# EAGLE schematic schematic (EAGLE 9.4.0)
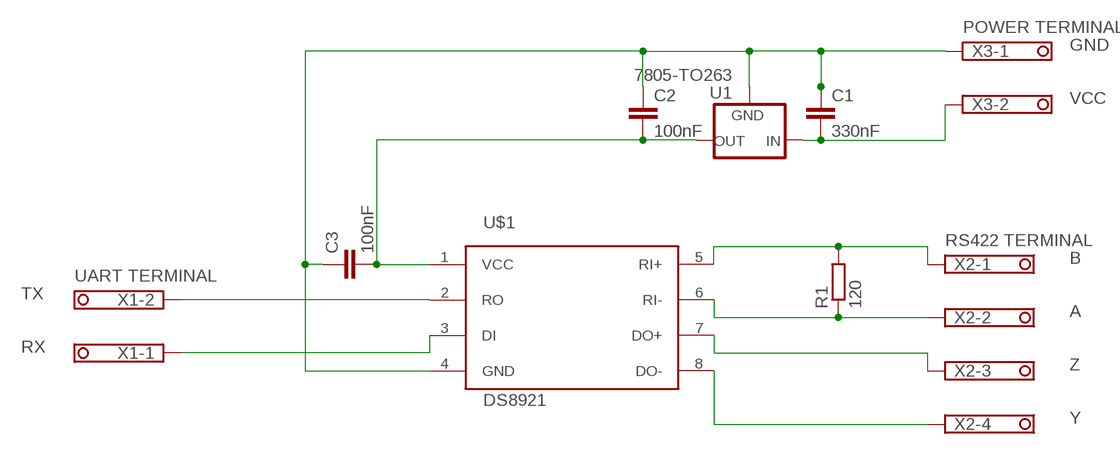
[diagram p0: schematic, sheet 1]

## Parts
C1  330nF  C-EUC1206K  [C1206K]
C2  100nF  C-EUC1206K  [C1206K]
C3  100nF  C-EUC1206K  [C1206K]
R1  120  R-EU_R1206  [R1206]
U1  7805-TO263  L78XXD2TT  [D2PAK]
U$1  DS8921  [SOIC8]
X1  1751248  [1751248]
X2  1751264  [1751264]
X3  1751248  [1751248]

## Nets
N$1: C1.1 C2.1 C3.1 U1.2(GND) U$1.4(GND) X3.1
N$2: C1.2 U1.1(IN) X3.2
N$3: C2.2 C3.2 U1.3(OUT) U$1.1(VCC)
N$4: U$1.2(RO) X1.2
N$5: U$1.3(DI) X1.1
N$7: R1.2 U$1.5(RI+) X2.1
N$8: U$1.7(DO+) X2.3
N$9: U$1.8(DO-) X2.4
N$10: R1.1 U$1.6(RI-) X2.2

## Notes on the sheet
- POWER TERMINAL
- GND
- VCC
- RS422 TERMINAL
- B
- UART TERMINAL
- TX
- A
- RX
- Z
- Y

## Library data of the parts
C1-C3 = rcl:C-EU: CAPACITOR, European symbol; SPICEPREFIX: C
R1 = rcl:R-EU_: RESISTOR, European symbol; SPICEPREFIX: R
U1 = v-reg-3:L78XX: VOLTAGE REGULATOR
U$1 = ref-packages:DS8921
X1 X3 = con-phoenix-350:1751248: MKDS 1/ 2-3,5 Printklemme Nennstrom: 10 A Bemessungsspannung: 160 V Raster: 3,5 mm Polzahl: 2 Montageart: Löten Anschlussart: Schraubanschluss Anschlussrichtung vom Leiter zur Platine: 0° Source: http://eshop.phoenixcontact.com .. 1751248.pdf; OC_FARNELL: unknown; OC_NEWARK: unknown
X2 = con-phoenix-350:1751264: MKDS 1/ 4-3,5 Printklemme Nennstrom: 10 A Bemessungsspannung: 160 V Raster: 3,5 mm Polzahl: 4 Montageart: Löten Anschlussart: Schraubanschluss Anschlussrichtung vom Leiter zur Platine: 0° Source: http://eshop.phoenixcontact.com .. 1751264.pdf; MPN: 1751264; OC_FARNELL: unknown; OC_NEWARK: 10R0934